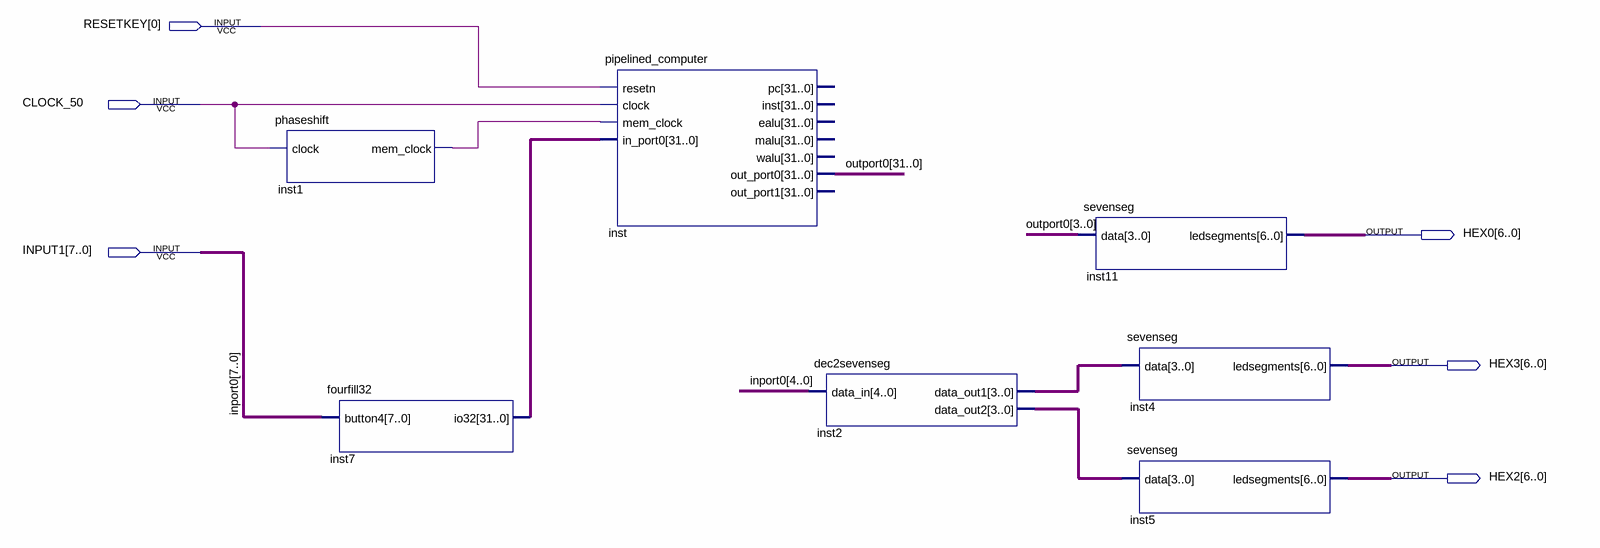
[diagram p0: schematic sheet]
// Quartus schematic pipeline_computer.bdf as structural Verilog: 7 symbols, 6 pins
module pipeline_computer (
  input  [0:0] RESETKEY,
  input  CLOCK_50,
  input  [7:0] INPUT1,
  output [6:0] HEX0,
  output [6:0] HEX3,
  output [6:0] HEX2
);

  wire inst1_mem_clock;
  wire [3:0] inst2_data_out1, inst2_data_out2;
  wire [31:0] inst7_io32, outport0;

  phaseshift inst1 (.clock(CLOCK_50), .mem_clock(inst1_mem_clock));
  fourfill32 inst7 (.button4(INPUT1), .io32(inst7_io32));
  pipelined_computer inst (
    .resetn(RESETKEY[0]), .clock(CLOCK_50), .mem_clock(inst1_mem_clock), .in_port0(inst7_io32),
    .out_port0(outport0));  // open: pc, inst, ealu, malu, walu, out_port1
  dec2sevenseg inst2 (.data_in(INPUT1[4:0]), .data_out1(inst2_data_out1), .data_out2(inst2_data_out2));
  sevenseg inst11 (.data(outport0[3:0]), .ledsegments(HEX0));
  sevenseg inst4 (.data(inst2_data_out1), .ledsegments(HEX3));
  sevenseg inst5 (.data(inst2_data_out2), .ledsegments(HEX2));

  // Other names for the same wires on the sheet: inport0[7:0] = INPUT1
endmodule
